# Altium schematic sheet ArmDebuger(4-7)JLink_V9.SchDoc
size 393 x 241 mm
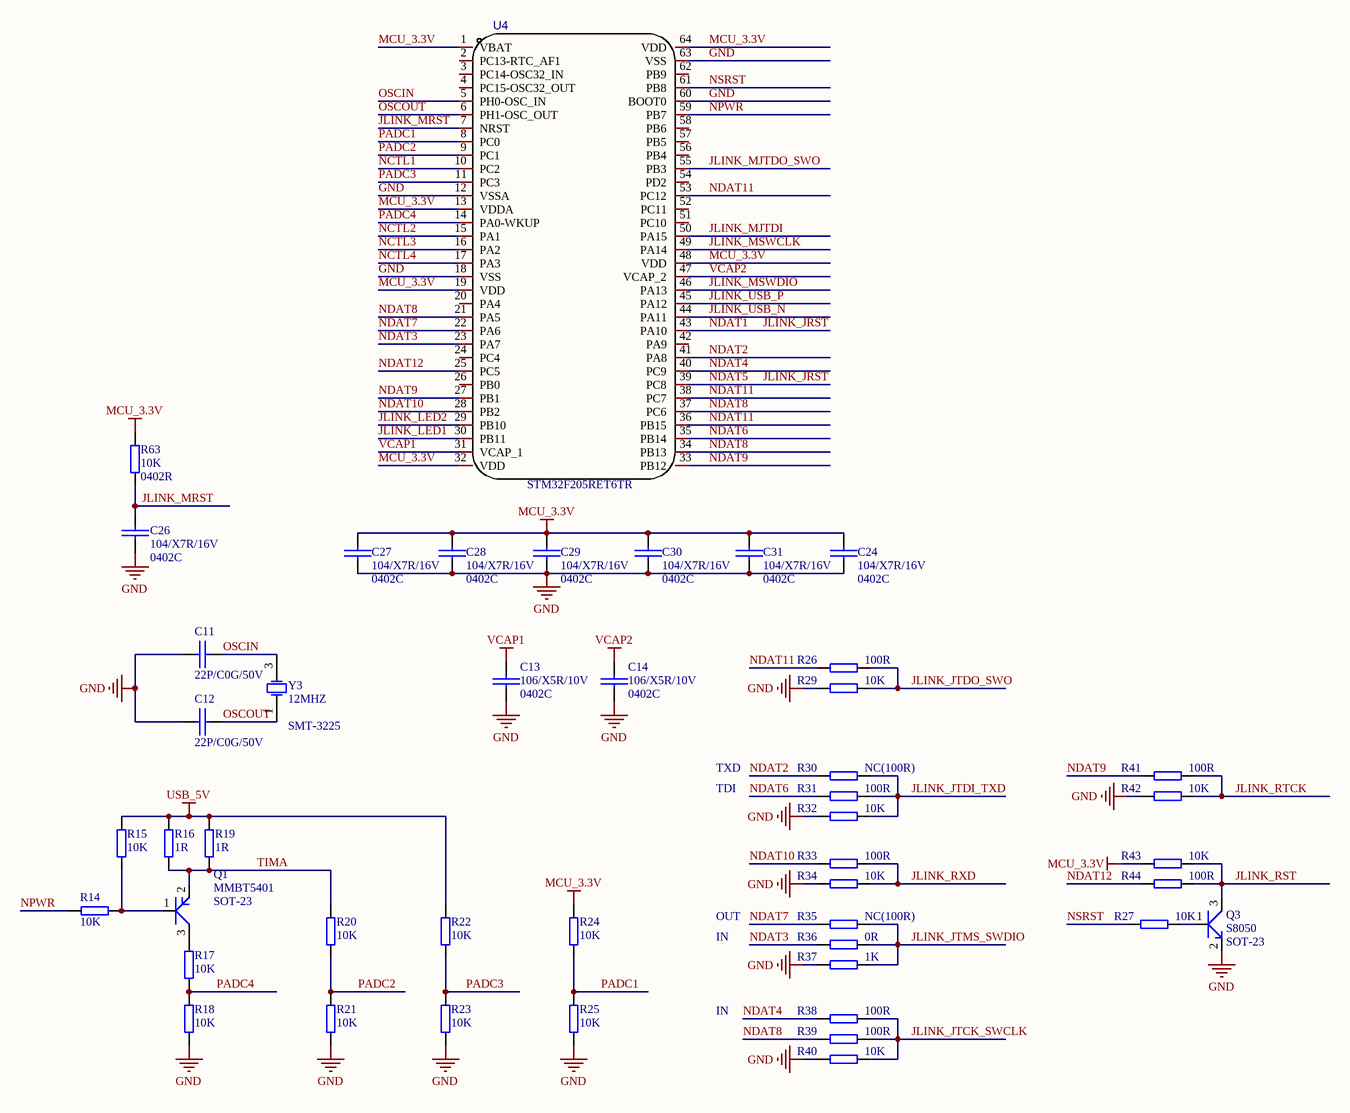
[diagram p0: ArmDebuger(4-7)JLink_V9.SchDoc]

## Parts
C11  22P/C0G/50V  [0402C-SMD-M]
C12  22P/C0G/50V  [0402C-SMD-M]
C13  106/X5R/10V  Fp: 0402C  [0402C-SMD-M]
C14  106/X5R/10V  Fp: 0402C  [0402C-SMD-M]
C24  104/X7R/16V  Fp: 0402C  [0402C-SMD-M]
C26  104/X7R/16V  Fp: 0402C  [0402C-SMD-M]
C27  104/X7R/16V  Fp: 0402C  [0402C-SMD-M]
C28  104/X7R/16V  Fp: 0402C  [0402C-SMD-M]
C29  104/X7R/16V  Fp: 0402C  [0402C-SMD-M]
C30  104/X7R/16V  Fp: 0402C  [0402C-SMD-M]
C31  104/X7R/16V  Fp: 0402C  [0402C-SMD-M]
Q1  MMBT5401  [SOT-23]
Q3  S8050  [SOT-23]
R14  10K  [0402R-SMD-M]
R15  10K  [0402R-SMD-M]
R16  1R  [0402R-SMD-M]
R17  10K  [0402R-SMD-M]
R18  10K  [0402R-SMD-M]
R19  1R  [0402R-SMD-M]
R20  10K  [0402R-SMD-M]
R21  10K  [0402R-SMD-M]
R22  10K  [0402R-SMD-M]
R23  10K  [0402R-SMD-M]
R24  10K  [0402R-SMD-M]
R25  10K  [0402R-SMD-M]
R26  100R  [0402R-SMD-M]
R27  10K  [0402R-SMD-M]
R29  10K  [0402R-SMD-M]
R30  NC(100R)  [0402R-SMD-M]
R31  100R  [0402R-SMD-M]
R32  10K  [0402R-SMD-M]
R33  100R  [0402R-SMD-M]
R34  10K  [0402R-SMD-M]
R35  NC(100R)  [0402R-SMD-M]
R36  0R  [0402R-SMD-M]
R37  1K  [0402R-SMD-M]
R38  100R  [0402R-SMD-M]
R39  100R  [0402R-SMD-M]
R40  10K  [0402R-SMD-M]
R41  100R  [0402R-SMD-M]
R42  10K  [0402R-SMD-M]
R43  10K  [0402R-SMD-M]
R44  100R  [0402R-SMD-M]
R63  10K  Fp: 0402R  [0402R-SMD-M]
U4  STM32F205RET6TR  [LQFP64_L]
Y3  12MHZ  Fp: SMT-3225  [CRYSTAL-SMT-3225]

## Nets
GND: C11.1 C12.1 C13.2 C14.2 C24.1 C26.1 C27.1 C28.1 C29.1 C30.1 C31.1 Q3.2(E) R18.2 R21.2 R23.2 R25.2 R29.1 R32.1 R34.1 R37.1 R40.1 R42.1 U4.12(VSSA) U4.18(VSS) U4.60(BOOT0) U4.63(VSS)
MCU_3.3V: C24.2 C27.2 C28.2 C29.2 C30.2 C31.2 R24.1 R43.1 R63.1 U4.1(VBAT) U4.13(VDDA) U4.19(VDD) U4.32(VDD) U4.48(VDD) U4.64(VDD)
USB_5V: R15.2 R16.1 R19.1 R22.1
VCAP1: C13.1 U4.31(VCAP_1)
VCAP2: C14.1 U4.47(VCAP_2)
JLINK_JRST: U4.39(PC8) U4.43(PA10)  [also labelled NDAT1, NDAT5]
JLINK_JTCK_SWCLK: R38.2 R39.2 R40.2
JLINK_JTDI_TXD: R30.2 R31.2 R32.2
JLINK_JTDO_SWO: R26.2 R29.2
JLINK_JTMS_SWDIO: R35.2 R36.2 R37.2
JLINK_LED1: U4.30(PB11)
JLINK_LED2: U4.29(PB10)
JLINK_MJTDI: U4.50(PA15)
JLINK_MJTDO_SWO: U4.55(PB3)
JLINK_MRST: C26.2 R63.2 U4.7(NRST)
JLINK_MSWCLK: U4.49(PA14)
JLINK_MSWDIO: U4.46(PA13)
JLINK_RST: Q3.3(C) R43.2 R44.2
JLINK_RTCK: R41.2 R42.2
JLINK_RXD: R33.2 R34.2
JLINK_USB_N: U4.44(PA11)
JLINK_USB_P: U4.45(PA12)
NCTL1: U4.10(PC2)
NCTL2: U4.15(PA1)
NCTL3: U4.16(PA2)
NCTL4: U4.17(PA3)
NDAT2: R30.1 U4.41(PA8)
NDAT3: R36.1 U4.23(PA7)
NDAT4: R38.1 U4.40(PC9)
NDAT6: R31.1 U4.35(PB14)
NDAT7: R35.1 U4.22(PA6)
NDAT8: R39.1 U4.21(PA5) U4.34(PB13) U4.37(PC6)
NDAT9: R41.1 U4.27(PB1) U4.33(PB12)
NDAT10: R33.1 U4.28(PB2)
NDAT11: R26.1 U4.36(PB15) U4.38(PC7) U4.53(PC12)
NDAT12: R44.1 U4.25(PC5)
NPWR: R14.2 U4.59(PB7)
NSRST: R27.1 U4.61(PB8)
OSCIN: C11.2 U4.5(PH0-OSC_IN) Y3.3(OSC2)
OSCOUT: C12.2 U4.6(PH1-OSC_OUT) Y3.1(OSC1)
PADC1: R24.2 R25.1 U4.8(PC0)
PADC2: R20.2 R21.1 U4.9(PC1)
PADC3: R22.2 R23.1 U4.11(PC3)
PADC4: R17.2 R18.1 U4.14(PA0-WKUP)
TIMA: Q1.2(E) R16.2 R19.2 R20.1
NetQ1_1: Q1.1(B) R14.1 R15.1
NetQ1_3: Q1.3(C) R17.1
NetQ3_1: Q3.1(B) R27.2

Not connected (* = marked no-connect by the designer): U4 2(PC13-RTC_AF1) 3(PC14-OSC32_IN) 4(PC15-OSC32_OUT) 20(PA4) 24(PC4) 26(PB0) 42(PA9) 51(PC10) 52(PC11) 54(PD2) 56(PB4) 57(PB5) 58(PB6) 62(PB9)

## Notes on the sheet
- TXD
- TDI
- OUT
- IN

## Library data of the parts
C11 C12 = CAP: Fp: 0402C; P/N: 06076; LCSC: C167428
C13 C14 = CAP: LCSC: C29266; P/N: ?
C24 C26-C31 = CAP: P/N: 06075; LCSC: C60474
Q1 = PNP-BEC: P/N: 02019; Fp: SOT-23; LCSC: C8326
Q3 = NPN-BEC: P/N: 02007; Fp: SOT-23; LCSC: C2891804
R14 R15 R17 R18 R20-R25 R27 R29 R32 R34 R40 R42 R43 = RES: Fp: 0402R; P/N: 04120; LCSC: C25744
R16 R19 = RES: Fp: 0402R; LCSC: C25086; P/N: ?
R26 R31 R33 R38 R39 R41 R44 = RES: Fp: 0402R; P/N: 04154; LCSC: C106232
R30 R35 = RES: Fp: 0402R; P/N: NC(04154); LCSC: NC
R36 = RES: Fp: 0402R; P/N: 04150; LCSC: C21376
R37 = RES: Fp: 0402R; P/N: 04123; LCSC: C11702
R63 = RES: P/N: 04120; LCSC: C25744
U4 = STM32F205RET6TR: Fp: LQFP64; P/N: ?; taobao: https://m.tb.cn/h.551KmY1?tk=9z7YWaFRN6v
Y3 = SMD-3225_4P  25MHZ 12PF 10PPM: 贴片晶振; P/N: 10009; LCSC: C133334